# EAGLE design parallel_paths_v1.0_100um (EAGLE 6.5.0)
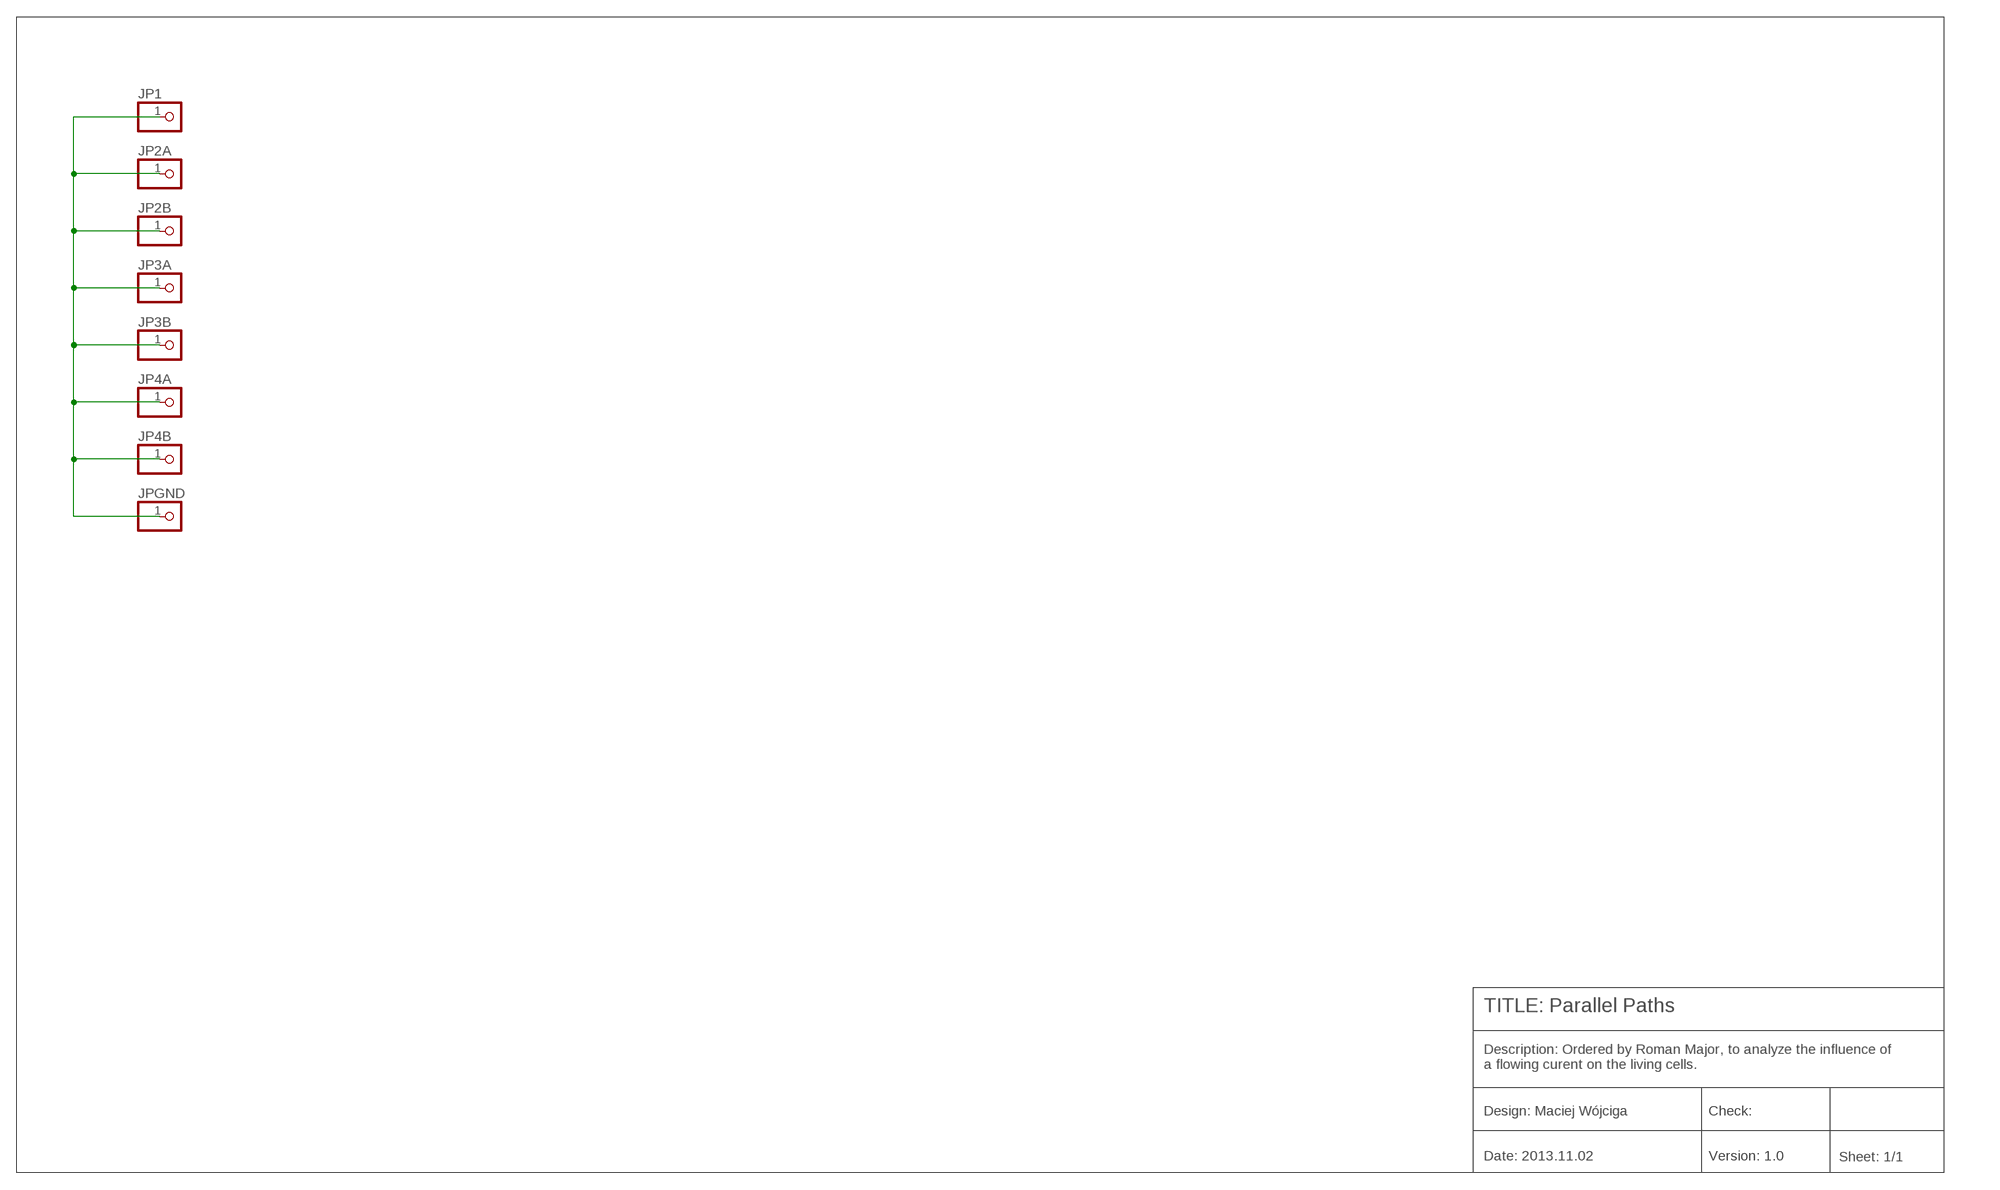
[diagram p0: schematic, sheet 1]

## Parts
JP1  PINHD-1X1  [1X01]
JP2A  PINHD-1X1  [1X01]
JP2B  PINHD-1X1  [1X01]
JP3A  PINHD-1X1  [1X01]
JP3B  PINHD-1X1  [1X01]
JP4A  PINHD-1X1  [1X01]
JP4B  PINHD-1X1  [1X01]
JPGND  PINHD-1X1  [1X01]

## Nets
N$1: JP1.1 JP2A.1 JP2B.1 JP3A.1 JP3B.1 JP4A.1 JP4B.1 JPGND.1

## Notes on the sheet
- TITLE: Parallel Paths
- Description: Ordered by Roman Major, to analyze the influence of
  a flowing curent on the living cells.
- Design: Maciej Wójciga | Check:
- Date: 2013.11.02 | Version: 1.0 | Sheet: 1/1

## Library data of the parts
JP1 JP2A JP2B JP3A JP3B JP4A JP4B JPGND = pinhead:PINHD-1X1: PIN HEADER

## Net classes
0 default: width 0.203 mm

## Board
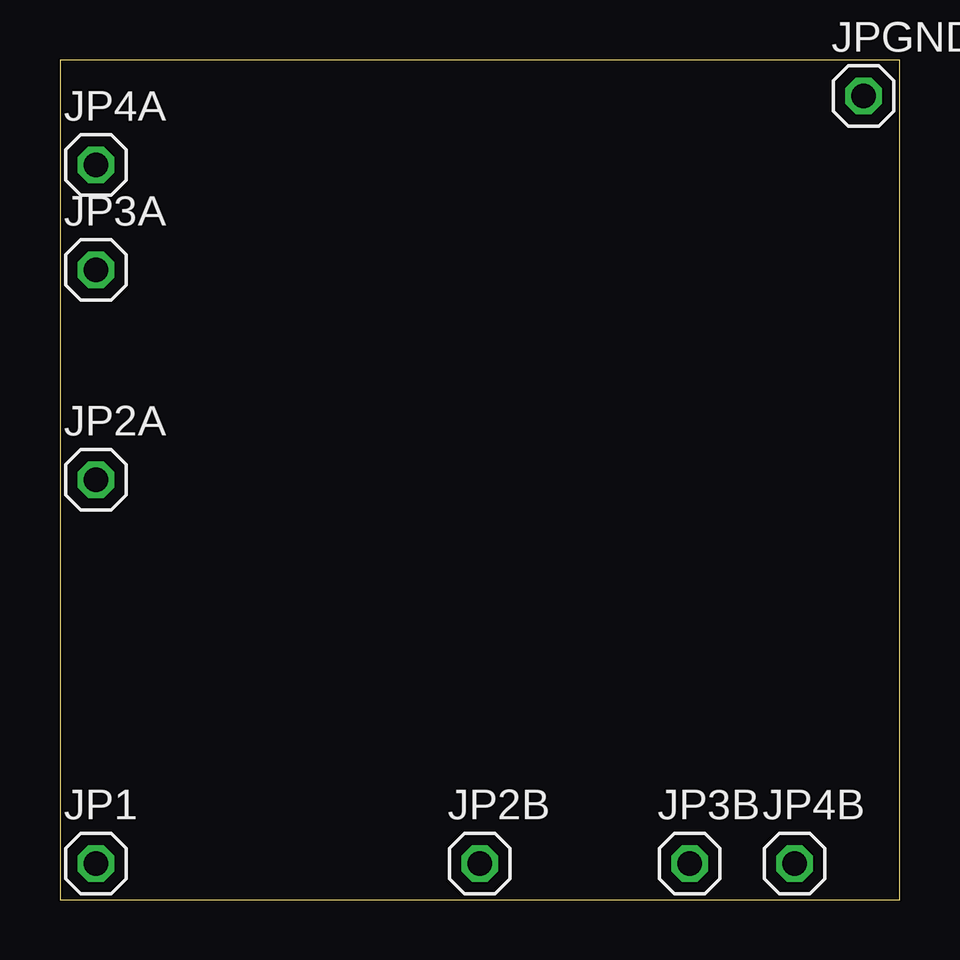
[diagram p1: board, top side]
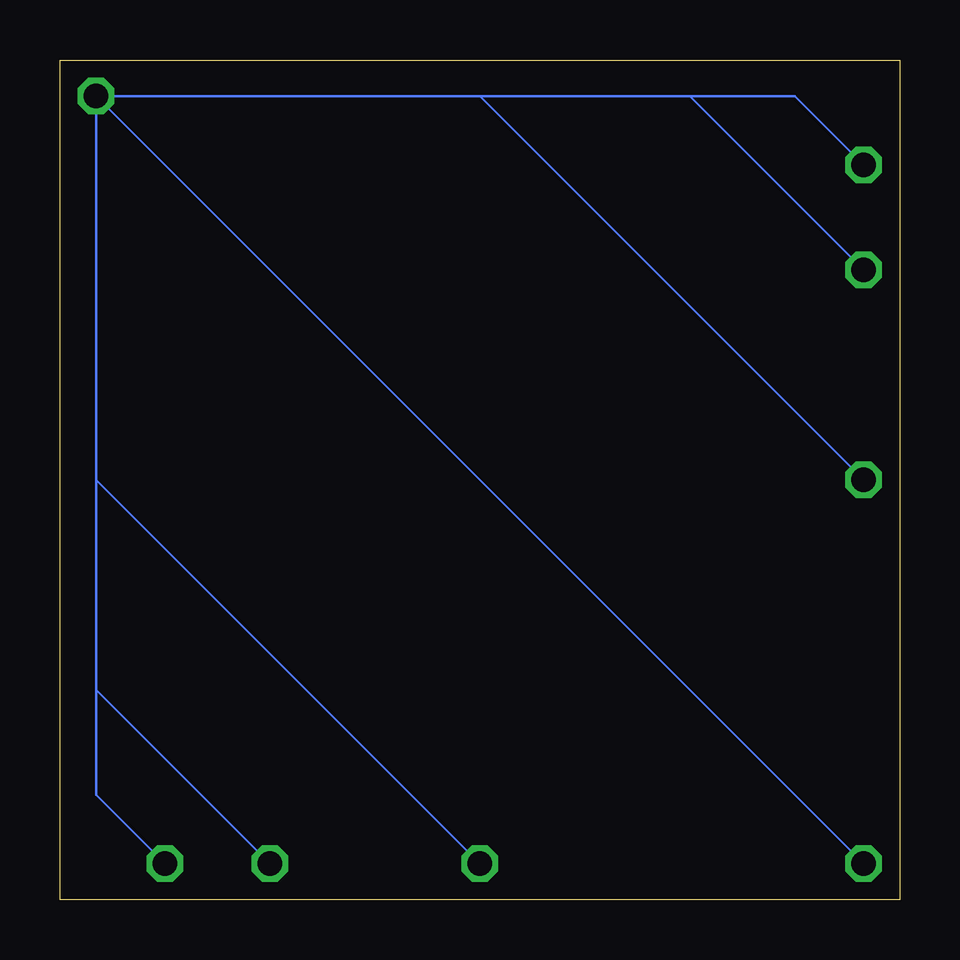
[diagram p2: board, bottom side, seen from below]

Size 35 x 35 mm. Coordinates in mm from the lower left corner, seen from the top.
Outline: 0,0 35,0 35,35 0,35 0,0
Copper layers (1*16): Top 0.035mm / dielectric 1.5mm / Bottom 0.035mm
Design rules "default": minimum track width 10mil, minimum drill 24mil, track to track 8mil, track to pad 8mil, pad to pad 8mil, via to via 8mil, smd to smd 8mil, copper to edge 40mil, drill to drill 8mil, minimum pad ring 10mil, minimum via ring 8mil, stop-mask expansion 4mil, vias tented up to drill 0mil, thermal gap 10mil

### Footprints (pad centres in the part's own frame; a part is rotated, then mirrored left to right if it is on the bottom)
1X01 = drill 1.016 octagon: 1 0,0

### Placement (x,y rotation side)
JP1  1.5,1.5 0 top
JP2A  1.5,17.5 0 top
JP2B  17.5,1.5 0 top
JP3A  1.5,26.25 0 top
JP3B  26.25,1.5 0 top
JP4A  1.5,30.62 0 top
JP4B  30.62,1.5 0 top
JPGND  33.5,33.5 0 top

### Tracks (layer width: path | path; a pad name or v marks a point on that pad's centre or on a via)
N$1
  Bottom 0.1: JP4A.1 4.38,33.5 8.75,33.5 | JP3A.1 8.75,33.5 | 8.75,33.5 17.5,33.5 | JP2A.1 17.5,33.5 | 17.5,33.5 JPGND.1 | JP1.1 JPGND.1 | JP2B.1 33.5,17.5 | 33.5,17.5 JPGND.1 | JP3B.1 33.5,8.75 | 33.5,8.75 33.5,9.5 33.5,17.5 | JP4B.1 33.5,4.38 33.5,8.75